# Altium schematic sheet Schematic.SchDoc
size A3; SheetNumber: 1; SheetTotal: 1
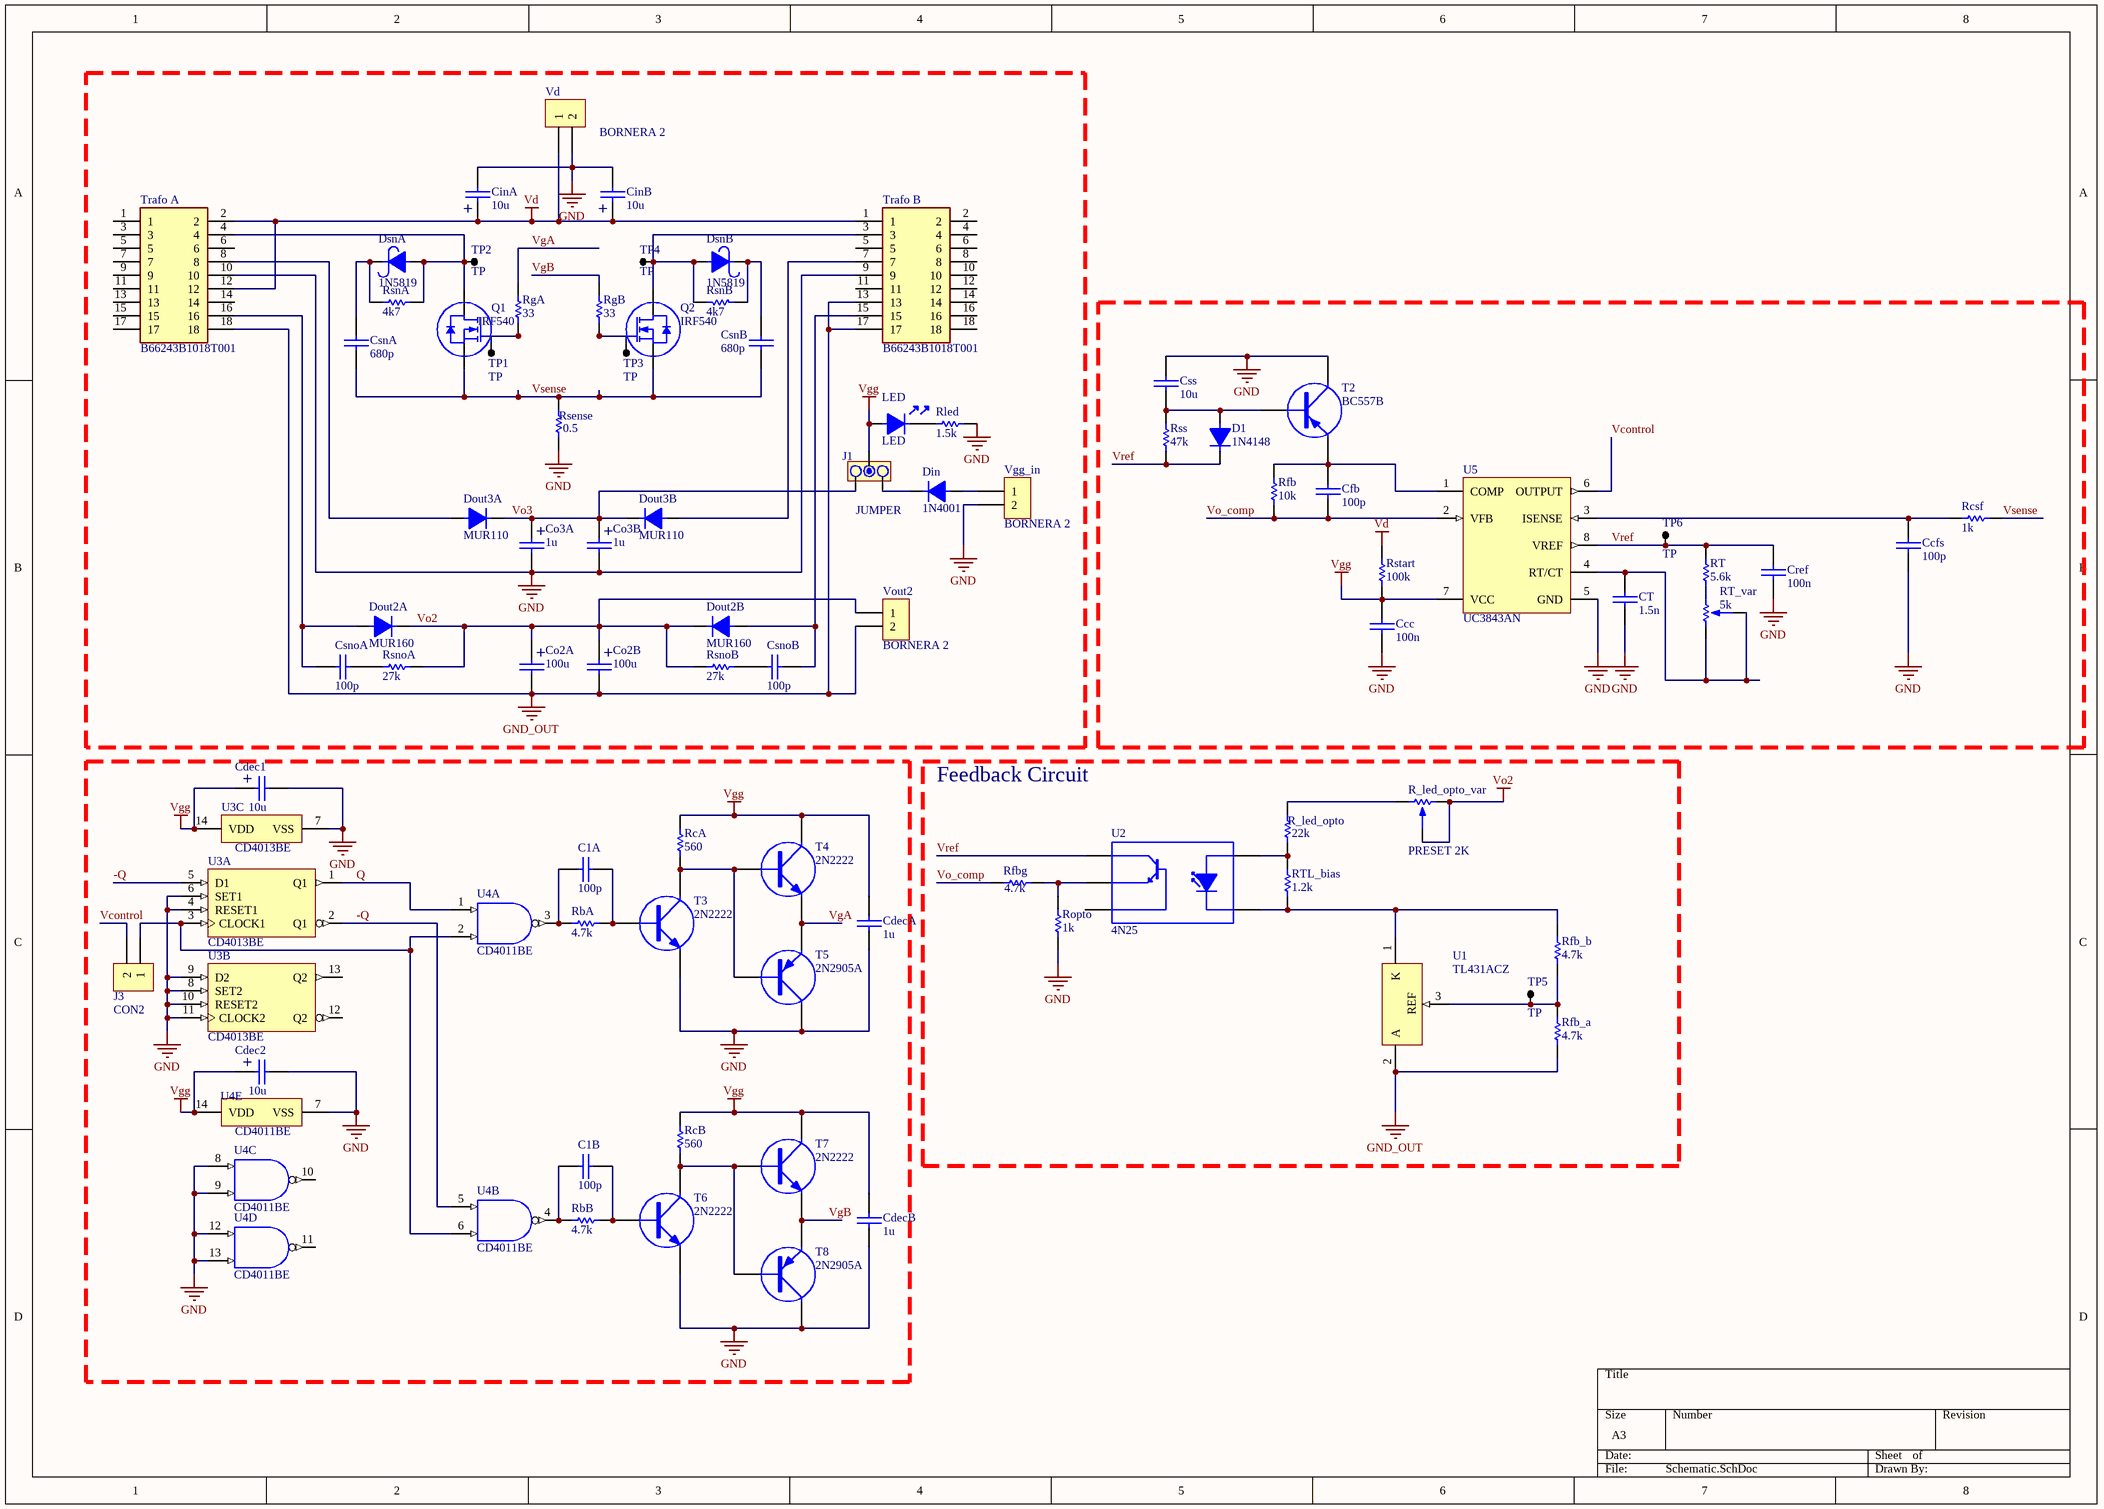
[diagram p0: Schematic.SchDoc]

## Parts
C1A  100p  [CAP100]
C1B  100p  [CAP100]
Ccc  100n  [CAP100]
Ccfs  100p  [CAP100]
Cdec1  10u  [CAP100RP2]
Cdec2  10u  [CAP100RP2]
CdecA  1u  [CAP200]
CdecB  1u  [CAP200]
Cfb  100p  [CAP100]
CinA  10u  [CAP100RP]
CinB  10u  [CAP100RP]
Co2A  100u  [CAP300RP]
Co2B  100u  [CAP300RP]
Co3A  1u  [CAP100RP]
Co3B  1u  [CAP100RP]
Cref  100n  [CAP100]
CsnA  680p  [CAP200]
CsnB  680p  [CAP200]
CsnoA  100p  [CAP100]
CsnoB  100p  [CAP100]
Css  10u  [CAP100]
CT  1.5n  [CAP100]
D1  1N4148  [DO41]
Din  1N4001  [DO41]
Dout2A  MUR160  [DO41]
Dout2B  MUR160  [DO41]
Dout3A  MUR110  [DO41]
Dout3B  MUR110  [DO41]
DsnA  1N5819  [DO41]
DsnB  1N5819  [DO41]
J1  JUMPER  [JUMPER3]
J3  CON2  [SIP2]
LED  LED  [LED3]
Q1  IRF540  [TO-220 V]
Q2  IRF540  [TO-220 V]
R_led_opto  22k  [RES600]
R_led_opto_var  PRESET 2K  [PRESET H]
RbA  4.7k  [RES400]
RbB  4.7k  [RES400]
RcA  560  [RES400]
RcB  560  [RES400]
Rcsf  1k  [RES400]
Rfb  10k  [RES400]
Rfb_a  4.7k  [RES400]
Rfb_b  4.7k  [RES400]
Rfbg  4.7k  [RES400]
RgA  33  [RES400]
RgB  33  [RES400]
Rled  1.5k  [RES400]
Ropto  1k  [RES400]
Rsense  0.5  [RES400]
RsnA  4k7  [RES600]
RsnB  4k7  [RES600]
RsnoA  27k  [RES600]
RsnoB  27k  [RES600]
Rss  47k  [RES400]
Rstart  100k  [RES400]
RT  5.6k  [RES400]
RT_var  5k  [PRESET V]
RTL_bias  1.2k  [RES400]
T2  BC557B  [TO92]
T3  2N2222  [TO92]
T4  2N2222  [TO92]
T5  2N2905A  [TO92]
T6  2N2222  [TO92]
T7  2N2222  [TO92]
T8  2N2905A  [TO92]
TP1  TP  [TPTH]
TP2  TP  [TPTH]
TP3  TP  [TPTH]
TP4  TP  [TPTH]
TP5  TP  [TPTH]
TP6  TP  [TPTH]
Trafo_A  B66243B1018T001  [B66243B1018T001]
Trafo_B  B66243B1018T001  [B66243B1018T001]
U1  TL431ACZ  [TO-92]
U2  4N25  [DIP6]
U3  CD4013BE  [N0014A]  (parts A,B,C of 3)
U4  CD4011BE  [N0014A]  (parts A,B,C,D,E of 5)
U5  UC3843AN  [P0008A]
Vd  BORNERA 2  [BORNERA2]
Vgg_in  BORNERA 2  [BORNERA2]
Vout2  BORNERA 2  [BORNERA2]

## Blocks framed on the sheet
Feedback Circuit: R_led_opto R_led_opto_var Rfb_a Rfb_b Rfbg Ropto RTL_bias TP5 U1 U2

## Nets
GND: Ccc.1 Ccfs.1 Cdec1.2 Cdec2.2 CdecA.1 CdecB.1 CinA.2 CinB.2 Co3A.2 Co3B.2 Cref.1 Css.1 CT.1 Rled.1 Ropto.1 Rsense.2 T2.2(C) T3.3(E) T5.2(C) T6.3(E) T8.2(C) Trafo_A.10 Trafo_B.9 U3.4(RESET1) U3.6(SET1) U3.7(VSS) U3.8(SET2) U3.9(D2) U3.10(RESET2) U3.11(CLOCK2) U4.7(VSS) U4.8(E) U4.9(F) U4.12(G) U4.13(H) U5.5(GND) Vd.2 Vgg_in.2
GND_OUT: Co2A.2 Co2B.2 Rfb_a.1 Trafo_A.18 Trafo_B.13 Trafo_B.17 U1.2(A) Vout2.2
Vd: CinA.1 CinB.1 Rstart.2 Trafo_A.2 Trafo_A.12 Trafo_B.1 Vd.1
Vgg: Ccc.2 Cdec1.1 Cdec2.1 CdecA.2 CdecB.2 J1.2 LED.1 RcA.1 RcB.1 Rstart.1 T4.2(C) T7.2(C) U3.14(VDD) U4.14(VDD) U5.7(VCC)
Vo2: Co2A.1 Co2B.1 Dout2A.2 Dout2B.2 R_led_opto_var.1 R_led_opto_var.2 RsnoA.2 RsnoB.2 Vout2.1
-Q: U3.2(Q1) U3.5(D1) U4.5(C)
Q: U3.1(Q1) U4.1(A)
Vcontrol: J3.2 U5.6(OUTPUT)
VgA: RgA.1 T4.3(E) T5.3(E)
VgB: RgB.1 T7.3(E) T8.3(E)
Vo3: Co3A.1 Co3B.1 Dout3A.2 Dout3B.2 J1.1
Vo_comp: Cfb.1 Rfb.1 Rfbg.1 U5.2(VFB)
Vref: Cref.2 D1.2 Rss.2 RT.2 TP6.1 U2.5(C) U5.8(VREF)
Vsense: CsnA.1 CsnB.1 Q1.3(S) Q2.3(S) Rcsf.1 Rsense.1
NetC1A_1: C1A.1 RbA.2 U4.3(J)
NetC1A_2: C1A.2 RbA.1 T3.1(B)
NetC1B_1: C1B.1 RbB.2 U4.4(K)
NetC1B_2: C1B.2 RbB.1 T6.1(B)
NetCcfs_2: Ccfs.2 Rcsf.2 U5.3(ISENSE)
NetCfb_2: Cfb.2 Rfb.2 T2.3(E) U5.1(COMP)
NetCsnA_2: CsnA.2 DsnA.2 RsnA.1
NetCsnB_2: CsnB.2 DsnB.2 RsnB.1
NetCsnoA_1: CsnoA.1 Dout2A.1 Trafo_A.16
NetCsnoA_2: CsnoA.2 RsnoA.1
NetCsnoB_1: CsnoB.1 Dout2B.1 Trafo_B.15
NetCsnoB_2: CsnoB.2 RsnoB.1
NetCss_2: Css.2 D1.1 Rss.1 T2.1(B)
NetCT_2: CT.2 RT_var.2 RT_var.3 U5.4(RT/CT)
NetDin_1: Din.1 Vgg_in.1
NetDin_2: Din.2 J1.3
NetDout3A_1: Dout3A.1 Trafo_A.8
NetDout3B_1: Dout3B.1 Trafo_B.7
NetDsnA_1: DsnA.1 Q1.2(D) RsnA.2 TP2.1 Trafo_A.4
NetDsnB_1: DsnB.1 Q2.2(D) RsnB.2 TP4.1 Trafo_B.3
NetJ3_1: J3.1 U3.3(CLOCK1) U4.2(B) U4.6(D)
NetLED_2: LED.2 Rled.2
NetQ1_1: Q1.1(G) RgA.2 TP1.1
NetQ2_1: Q2.1(G) RgB.2 TP3.1
NetR_led_opto_1: R_led_opto.1 RTL_bias.2 U2.1(A)
NetR_led_opto_2: R_led_opto.2 R_led_opto_var.3
NetRcA_2: RcA.2 T3.2(C) T4.1(B) T5.1(B)
NetRcB_2: RcB.2 T6.2(C) T7.1(B) T8.1(B)
NetRfb_a_2: Rfb_a.2 Rfb_b.1 TP5.1 U1.3(REF)
NetRfb_b_2: Rfb_b.2 RTL_bias.1 U1.1(K) U2.2(K)
NetRfbg_2: Rfbg.2 Ropto.2 U2.4(E)
NetRT_1: RT.1 RT_var.1

Not connected (* = marked no-connect by the designer): Trafo_A 1 3 5 6 7 9 11 13 14 15 17; Trafo_B 2 4 5 6 8 10 11 12 14 16 18; U2 6(B); U3 12(Q2) 13(Q2); U4 10(L) 11(M)

## Notes on the sheet
- (in symbol CAPPOL) +

## Library data of the parts
C1A C1B Ccc Ccfs CdecA CdecB Cfb Cref CsnA CsnB CsnoA CsnoB Css CT = CAP
Cdec1 Cdec2 CinA CinB Co2A Co2B Co3A Co3B = CAPPOL
D1 Din Dout2A Dout2B Dout3A Dout3B = DIODO
DsnA DsnB = DIODO SCHOTTKY
J1 = JUMPER3
Q1 Q2 = MOSFET N
R_led_opto RbA RbB RcA RcB Rcsf Rfb Rfb_a Rfb_b Rfbg RgA RgB Rled Ropto Rsense RsnA RsnB RsnoA RsnoB Rss Rstart RT RTL_bias = RES
R_led_opto_var RT_var = PRESET
T2 T5 T8 = TRANSISTOR PNP
T3 T4 T6 T7 = TRANSISTOR NPN
Trafo_A Trafo_B = B66243B1018T001: Inductor; Manufacturer_Name: TDK; Datasheet Link: https://product.tdk.com/system/files/dam/doc/product/ferrite/ferrite/ferrite-acc/data_sheet/80/db/fer/e_42_21_20.pdf; Height: 51mm; Manufacturer_Part_Number: B66243B1018T001; Mouser Part Number: N/A; Mouser Price/Stock: https://www.mouser.co.uk/ProductDetail/EPCOS-TDK/B66243B1018T001?qs=W0yvOO0ixfHL1dNOx1DZxg%3D%3D; Arrow Part Number: B66243B1018T001; Arrow Price/Stock: https://www.arrow.com/en/products/b66243b1018t001/epcos-tdk
U1 = CMP-0242-00006-1: Programmable Voltage Reference, 2.5 to 36V, 3-Pin TO-92; ComponentLink2URL: http://www.st.com/internet/com/TECHNICAL_RESOURCES/TECHNICAL_LITERATURE/DATASHEET/CD00000986.pdf; PackageDescription: TO, Flat Index; 3 In-Line, Axial Leads; Body Dia. 4.7mm; Lead Dia. 0.56 mm (max); ComponentLink1Description: Manufacturer URL; PackageVersion: 2011; ComponentLink2Description: Datasheet; ComponentLink1URL: http://www.st.com; DatasheetVersion: Oct-2011; PackageReference: TO-92
U3 = CMP-1619-00744-2: CMOS Dual D-Type Flip Flop, N0014A, TUBE; Manufacturer: Texas Instruments; Schmitt Trigger: No; F @ Nom Voltage(Max)(Mhz): 8; tpd @ Nom Voltage(Max)(ns): 130; Output Logic: Inverted,Non-inverted; Rating: Military; Technology Family: CD4000; Voltage(Nom)(V): 10; Bits(#): 2; Output Drive (IOL/IOH)(Max)(mA): 1.5/-1.5; VCC(Min)(V): 3; VCC(Max)(V): 18; ICC @ Nom Voltage(Max)(mA): 0.06; Generic Part Number: CD4013B; 3-State Output: No; DatasheetVersion: SCHS023D; Input Type: CMOS; Code_JEDEC: MS-001; Operating Temperature Range(C): -55 to 125; PackageReference: N0014A; Output Type: CMOS
U4 = CMP-1627-00488-2: CMOS Quad 2-Input NAND Gate, N0014A, TUBE; Manufacturer: Texas Instruments; Schmitt Trigger: No; Bits(#): 4; Voltage(Nom)(V): 10; Output Drive (IOL/IOH)(Max)(mA): 1.5/-1.5; ICC @ Nom Voltage(Max)(mA): 0.015; Technology Family: CD4000; VCC(Max)(V): 18; Rating: Military; VCC(Min)(V): 3; F @ Nom Voltage(Max)(Mhz): 8; Output Type: CMOS; Input Type: CMOS; PackageReference: N0014A; Code_JEDEC: MS-001; Operating Temperature Range(C): -55 to 125; Generic Part Number: CD4011B; DatasheetVersion: SCHS021D
U5 = CMP-0319-00327-2: PWM Controller with Current Control, 100 % Duty Cycle, 0 to +70 degC, 8-pin PDIP (P), Green (RoHS & no Sb/Br); Manufacturer: Texas Instruments; Duty Cycle(Max)(%): 100; Regulated Outputs(#): 1; Rating: Catalog; Topology: Boost, Buck, Flyback, Forward; Frequency(Max)(kHz): 450; UVLO Thresholds On/Off(V): 8.4/7.6; SubFamily: PWM Controller; PackageReference: P0008A; Mounting Technology: Through Hole; PackageVersion: revE, Apr-2010; PackageDescription: 8-Pin Plastic Dual-In-Line Package, Row Spacing 7.62 mm, Pitch 2.54 mm; Code_JEDEC: MS-001-BA; PartNumber: UC3843AN; DatasheetVersion: SLUS224C; ComponentLink1Description: Datasheet; Eco-Plan: Green (RoHS & no Sb/Br); ComponentLink1URL: http://www.ti.com/general/docs/lit/getliterature.tsp?genericPartNumber=UC3843A&fileType=pdf; Control Method: Current